# Altium project PDC_2019_rev2.PrjPcb
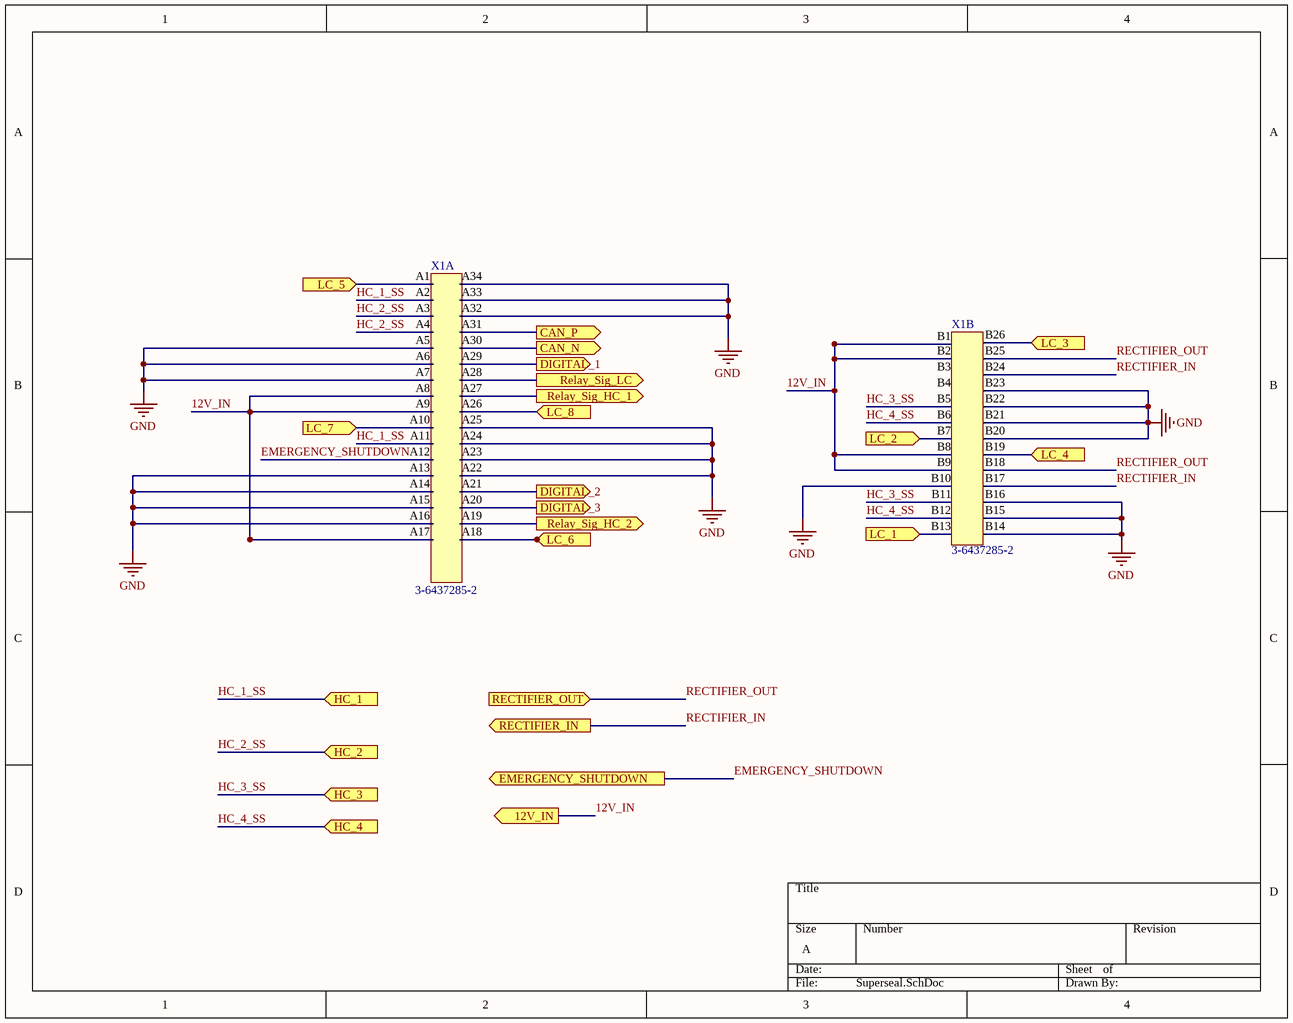
[diagram p0: Superseal.SchDoc]
9 sheets, 47 parts. Net scope: hierarchical (ports join the sheet entries above them; power ports are global).
Sheets:
  Superseal.SchDoc
  LOW_CURRENT_OUTPUTS.SchDoc
    U_Low_Current_Gate_Driver = Low_Current_Gate_Driver.SchDoc
    U_Low_Current_Gate_Driver = Low_Current_Gate_Driver.SchDoc
  HIGH_CURRENT_OUTPUT.SchDoc
    U_PDC_high_Current_Outputs = PDC_high_Current_Outputs.SchDoc
    U_PDC_high_Current_Outputs = PDC_high_Current_Outputs.SchDoc
    U_PDC_high_Current_Outputs = PDC_high_Current_Outputs.SchDoc
    U_PDC_high_Current_Outputs = PDC_high_Current_Outputs.SchDoc
  E_STOP_&_HIGH_CURRENT_GATE_DRIVE.SchDoc
  RECTIFIER_SHUTDOWN_CCT.SchDoc
  ANALOG_HC_OVERCURRENT_REDUCNDANCY.SchDoc
    U_Analog_HC_Overcurrent_Redundancy = Analog_HC_Overcurrent_Redundancy.SchDoc
    U_Analog_HC_Overcurrent_Redundancy = Analog_HC_Overcurrent_Redundancy.SchDoc
    U_Analog_HC_Overcurrent_Redundancy = Analog_HC_Overcurrent_Redundancy.SchDoc
    U_Analog_HC_Overcurrent_Redundancy = Analog_HC_Overcurrent_Redundancy.SchDoc

## Sheet Superseal.SchDoc
size A

### Parts
X1  3-6437285-2  [SUPERSEAL 60POS 90Deg]  (parts A,B of 2)

### Ports
12V_IN (out), CAN_N (out), CAN_P (out), DIGITAL_1 (out), DIGITAL_2 (out), DIGITAL_3 (out), EMERGENCY_SHUTDOWN (out), HC_1 (in), HC_2 (in), HC_3 (in), HC_4 (in), LC_1 (in), LC_2 (in), LC_3 (in), LC_4 (in), LC_5 (in), LC_6 (in), LC_7 (in), LC_8 (in), RECTIFIER_IN (out), RECTIFIER_OUT (in), Relay_Sig_HC_1 (out), Relay_Sig_HC_2 (out), Relay_Sig_LC (out)

### Nets
GND: X1.A5 X1.A6 X1.A7 X1.A13 X1.A14 X1.A15 X1.A16 X1.A22 X1.A23 X1.A24 X1.A25 X1.A32 X1.A33 X1.A34 X1.B10 X1.B14 X1.B15 X1.B16 X1.B20 X1.B21 X1.B22 X1.B23
12V_IN: X1.A8 X1.A9 X1.A17 X1.B1 X1.B2 X1.B8 X1.B9 ; port 12V_IN
EMERGENCY_SHUTDOWN: X1.A12 ; port EMERGENCY_SHUTDOWN
HC_1_SS: X1.A2 X1.A11 ; port HC_1
HC_2_SS: X1.A3 X1.A4 ; port HC_2
HC_3_SS: X1.B5 X1.B11 ; port HC_3
HC_4_SS: X1.B6 X1.B12 ; port HC_4
RECTIFIER_IN: X1.B17 X1.B24 ; port RECTIFIER_IN
RECTIFIER_OUT: X1.B18 X1.B25 ; port RECTIFIER_OUT
NetX1_A1: X1.A1 ; port LC_5
NetX1_A10: X1.A10 ; port LC_7
NetX1_A18: X1.A18 ; port LC_6
NetX1_A19: X1.A19 ; port Relay_Sig_HC_2
NetX1_A20: X1.A20 ; port DIGITAL_3
NetX1_A21: X1.A21 ; port DIGITAL_2
NetX1_A26: X1.A26 ; port LC_8
NetX1_A27: X1.A27 ; port Relay_Sig_HC_1
NetX1_A28: X1.A28 ; port Relay_Sig_LC
NetX1_A29: X1.A29 ; port DIGITAL_1
NetX1_A30: X1.A30 ; port CAN_N
NetX1_A31: X1.A31 ; port CAN_P
NetX1_B7: X1.B7 ; port LC_2
NetX1_B13: X1.B13 ; port LC_1
NetX1_B19: X1.B19 ; port LC_4
NetX1_B26: X1.B26 ; port LC_3

Not connected (* = marked no-connect by the designer): X1 B3 B4

### Library data of the parts
X1 = 3: 90 Degree; Manufacturer_id: 1; idConn: 3; Name: AMP Superseal 60POS 90Deg; Value: CONN; Num_Contacts: 60; Num_Rows: 4; Pitch: 3 mm; MfrPartNo: 3-6437285-2; Drawer_id: 1; Link: https://www.te.com/usa-en/product-3-6437285-2.html; ComponentLink1Description: Datasheet

## Sheet LOW_CURRENT_OUTPUTS.SchDoc
size A2
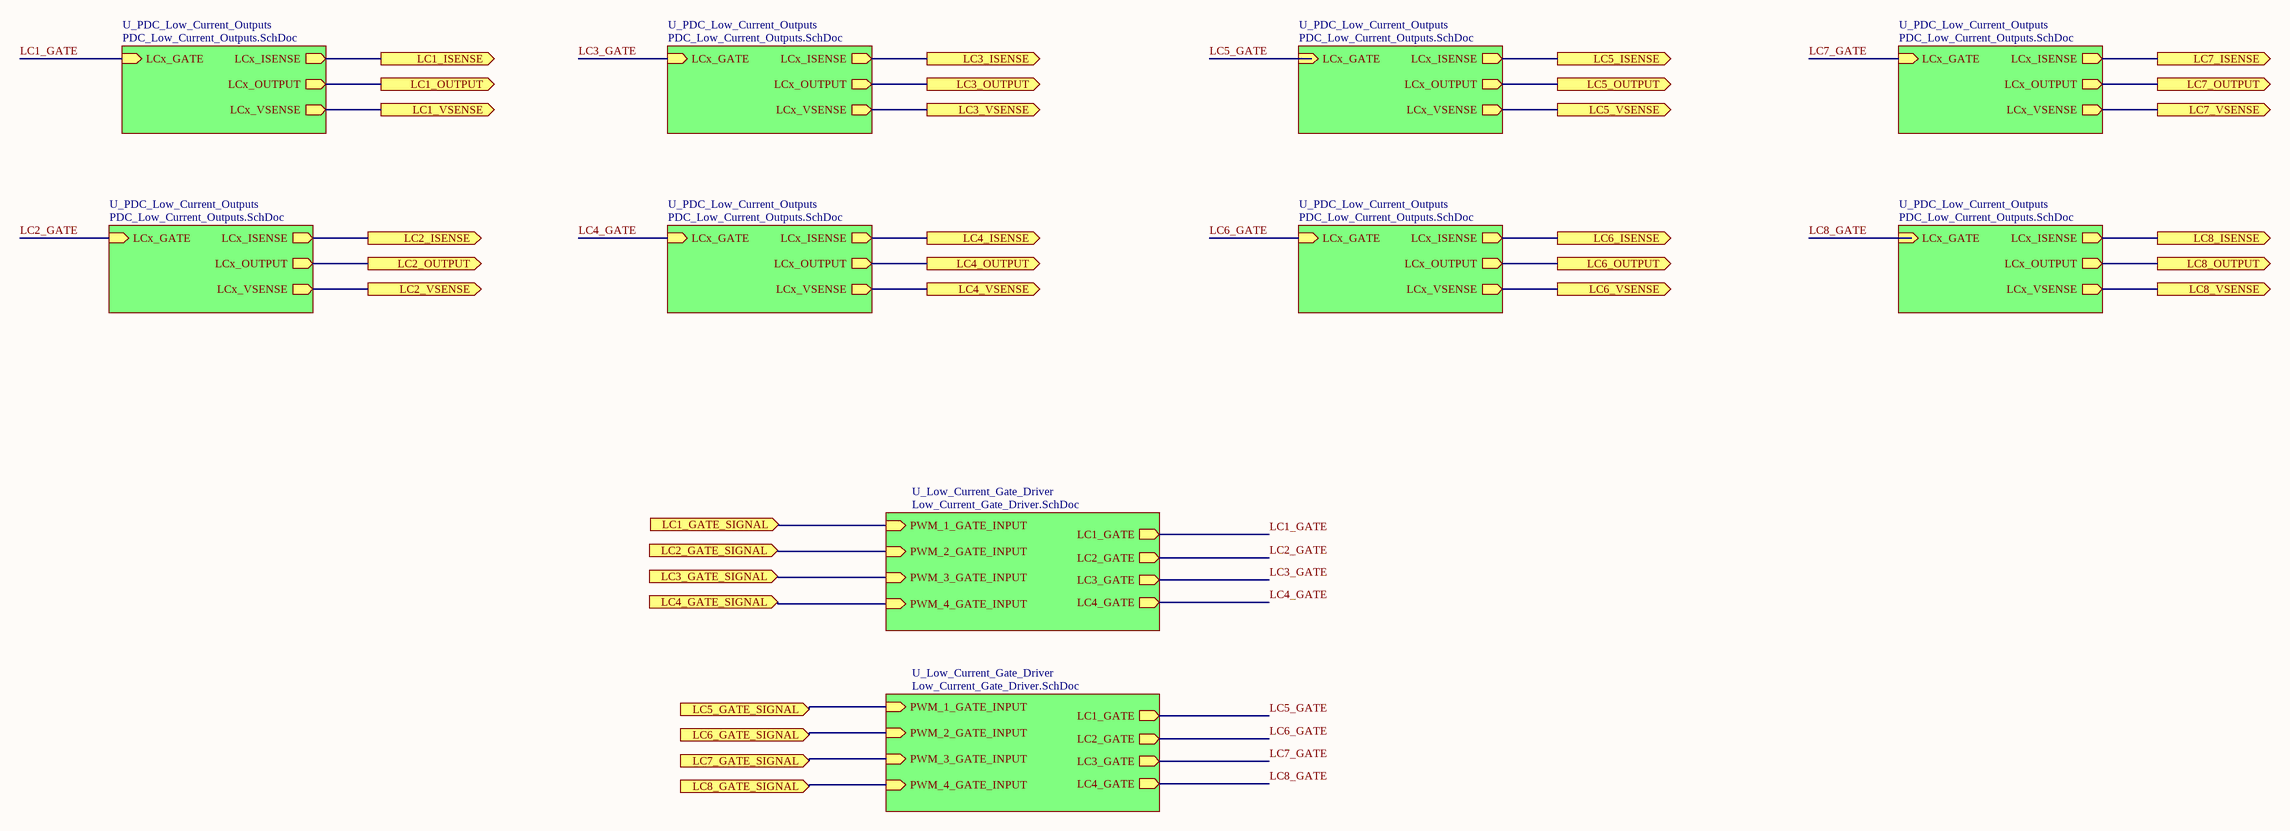
[diagram p1: LOW_CURRENT_OUTPUTS.SchDoc]

### Sub-sheets
U_Low_Current_Gate_Driver = Low_Current_Gate_Driver.SchDoc: LC4_GATE (out), LC2_GATE (out), LC1_GATE (out), LC3_GATE (out), PWM_1_GATE_INPUT (in), PWM_2_GATE_INPUT (in), PWM_3_GATE_INPUT (in), PWM_4_GATE_INPUT (in)
U_Low_Current_Gate_Driver = Low_Current_Gate_Driver.SchDoc: LC4_GATE (out), LC2_GATE (out), LC1_GATE (out), LC3_GATE (out), PWM_1_GATE_INPUT (in), PWM_2_GATE_INPUT (in), PWM_3_GATE_INPUT (in), PWM_4_GATE_INPUT (in)
U_PDC_Low_Current_Outputs = PDC_Low_Current_Outputs.SchDoc (file not in this document): LCx_ISENSE (out), LCx_OUTPUT (out), LCx_VSENSE (out), LCx_GATE (in)
U_PDC_Low_Current_Outputs = PDC_Low_Current_Outputs.SchDoc (file not in this document): LCx_ISENSE (out), LCx_OUTPUT (out), LCx_VSENSE (out), LCx_GATE (in)
U_PDC_Low_Current_Outputs = PDC_Low_Current_Outputs.SchDoc (file not in this document): LCx_ISENSE (out), LCx_OUTPUT (out), LCx_VSENSE (out), LCx_GATE (in)
U_PDC_Low_Current_Outputs = PDC_Low_Current_Outputs.SchDoc (file not in this document): LCx_ISENSE (out), LCx_OUTPUT (out), LCx_VSENSE (out), LCx_GATE (in)
U_PDC_Low_Current_Outputs = PDC_Low_Current_Outputs.SchDoc (file not in this document): LCx_ISENSE (out), LCx_OUTPUT (out), LCx_VSENSE (out), LCx_GATE (in)
U_PDC_Low_Current_Outputs = PDC_Low_Current_Outputs.SchDoc (file not in this document): LCx_ISENSE (out), LCx_OUTPUT (out), LCx_VSENSE (out), LCx_GATE (in)
U_PDC_Low_Current_Outputs = PDC_Low_Current_Outputs.SchDoc (file not in this document): LCx_ISENSE (out), LCx_OUTPUT (out), LCx_VSENSE (out), LCx_GATE (in)
U_PDC_Low_Current_Outputs = PDC_Low_Current_Outputs.SchDoc (file not in this document): LCx_ISENSE (out), LCx_OUTPUT (out), LCx_VSENSE (out), LCx_GATE (in)

### Ports
LC1_GATE_SIGNAL (in), LC1_ISENSE (out), LC1_OUTPUT (out), LC1_VSENSE (out), LC2_GATE_SIGNAL (in), LC2_ISENSE (out), LC2_OUTPUT (out), LC2_VSENSE (out), LC3_GATE_SIGNAL (in), LC3_ISENSE (out), LC3_OUTPUT (out), LC3_VSENSE (out), LC4_GATE_SIGNAL (in), LC4_ISENSE (out), LC4_OUTPUT (out), LC4_VSENSE (out), LC5_GATE_SIGNAL (in), LC5_ISENSE (out), LC5_OUTPUT (out), LC5_VSENSE (out), LC6_GATE_SIGNAL (in), LC6_ISENSE (out), LC6_OUTPUT (out), LC6_VSENSE (out), LC7_GATE_SIGNAL (in), LC7_ISENSE (out), LC7_OUTPUT (out), LC7_VSENSE (out), LC8_GATE_SIGNAL (in), LC8_ISENSE (out), LC8_OUTPUT (out), LC8_VSENSE (out)

### Nets
LC1_GATE: sheet U_PDC_Low_Current_Outputs/LCx_GATE, sheet U_Low_Current_Gate_Driver/LC1_GATE
LC2_GATE: sheet U_PDC_Low_Current_Outputs/LCx_GATE, sheet U_Low_Current_Gate_Driver/LC2_GATE
LC3_GATE: sheet U_PDC_Low_Current_Outputs/LCx_GATE, sheet U_Low_Current_Gate_Driver/LC3_GATE
LC4_GATE: sheet U_PDC_Low_Current_Outputs/LCx_GATE, sheet U_Low_Current_Gate_Driver/LC4_GATE
LC5_GATE: sheet U_PDC_Low_Current_Outputs/LCx_GATE, sheet U_Low_Current_Gate_Driver/LC1_GATE
LC6_GATE: sheet U_PDC_Low_Current_Outputs/LCx_GATE, sheet U_Low_Current_Gate_Driver/LC2_GATE
LC7_GATE: sheet U_PDC_Low_Current_Outputs/LCx_GATE, sheet U_Low_Current_Gate_Driver/LC3_GATE
LC8_GATE: sheet U_PDC_Low_Current_Outputs/LCx_GATE, sheet U_Low_Current_Gate_Driver/LC4_GATE
NetIC4_U_Low_Current_Gate_Driver#1_3: port LC5_GATE_SIGNAL, sheet U_Low_Current_Gate_Driver/PWM_1_GATE_INPUT
NetIC4_U_Low_Current_Gate_Driver#1_5: port LC6_GATE_SIGNAL, sheet U_Low_Current_Gate_Driver/PWM_2_GATE_INPUT
NetIC4_U_Low_Current_Gate_Driver#1_7: port LC7_GATE_SIGNAL, sheet U_Low_Current_Gate_Driver/PWM_3_GATE_INPUT
NetIC4_U_Low_Current_Gate_Driver#1_9: port LC8_GATE_SIGNAL, sheet U_Low_Current_Gate_Driver/PWM_4_GATE_INPUT
NetIC4_U_Low_Current_Gate_Driver#2_3: port LC1_GATE_SIGNAL, sheet U_Low_Current_Gate_Driver/PWM_1_GATE_INPUT
NetIC4_U_Low_Current_Gate_Driver#2_5: port LC2_GATE_SIGNAL, sheet U_Low_Current_Gate_Driver/PWM_2_GATE_INPUT
NetIC4_U_Low_Current_Gate_Driver#2_7: port LC3_GATE_SIGNAL, sheet U_Low_Current_Gate_Driver/PWM_3_GATE_INPUT
NetIC4_U_Low_Current_Gate_Driver#2_9: port LC4_GATE_SIGNAL, sheet U_Low_Current_Gate_Driver/PWM_4_GATE_INPUT
(unnamed): port LC3_ISENSE, sheet U_PDC_Low_Current_Outputs/LCx_ISENSE
(unnamed): port LC3_OUTPUT, sheet U_PDC_Low_Current_Outputs/LCx_OUTPUT
(unnamed): port LC3_VSENSE, sheet U_PDC_Low_Current_Outputs/LCx_VSENSE
(unnamed): port LC4_ISENSE, sheet U_PDC_Low_Current_Outputs/LCx_ISENSE
(unnamed): port LC4_OUTPUT, sheet U_PDC_Low_Current_Outputs/LCx_OUTPUT
(unnamed): port LC4_VSENSE, sheet U_PDC_Low_Current_Outputs/LCx_VSENSE
(unnamed): port LC1_ISENSE, sheet U_PDC_Low_Current_Outputs/LCx_ISENSE
(unnamed): port LC1_OUTPUT, sheet U_PDC_Low_Current_Outputs/LCx_OUTPUT
(unnamed): port LC1_VSENSE, sheet U_PDC_Low_Current_Outputs/LCx_VSENSE
(unnamed): port LC2_ISENSE, sheet U_PDC_Low_Current_Outputs/LCx_ISENSE
(unnamed): port LC2_OUTPUT, sheet U_PDC_Low_Current_Outputs/LCx_OUTPUT
(unnamed): port LC2_VSENSE, sheet U_PDC_Low_Current_Outputs/LCx_VSENSE
(unnamed): port LC5_ISENSE, sheet U_PDC_Low_Current_Outputs/LCx_ISENSE
(unnamed): port LC6_ISENSE, sheet U_PDC_Low_Current_Outputs/LCx_ISENSE
(unnamed): port LC6_OUTPUT, sheet U_PDC_Low_Current_Outputs/LCx_OUTPUT
(unnamed): port LC6_VSENSE, sheet U_PDC_Low_Current_Outputs/LCx_VSENSE
(unnamed): port LC7_ISENSE, sheet U_PDC_Low_Current_Outputs/LCx_ISENSE
(unnamed): port LC7_OUTPUT, sheet U_PDC_Low_Current_Outputs/LCx_OUTPUT
(unnamed): port LC7_VSENSE, sheet U_PDC_Low_Current_Outputs/LCx_VSENSE
(unnamed): port LC8_ISENSE, sheet U_PDC_Low_Current_Outputs/LCx_ISENSE
(unnamed): port LC8_OUTPUT, sheet U_PDC_Low_Current_Outputs/LCx_OUTPUT
(unnamed): port LC8_VSENSE, sheet U_PDC_Low_Current_Outputs/LCx_VSENSE
(unnamed): port LC5_OUTPUT, sheet U_PDC_Low_Current_Outputs/LCx_OUTPUT
(unnamed): port LC5_VSENSE, sheet U_PDC_Low_Current_Outputs/LCx_VSENSE

### Notes on the sheet
- Title
- Size:
- Date:
- File:
- A2
- Number:
- Time:
- Revision:
- Sheet
- of

## Sheet Low_Current_Gate_Driver.SchDoc
size A
Used 2 times, as channels U_Low_Current_Gate_Driver, U_Low_Current_Gate_Driver. Parts and nets are listed once, with the designators drawn on the sheet.
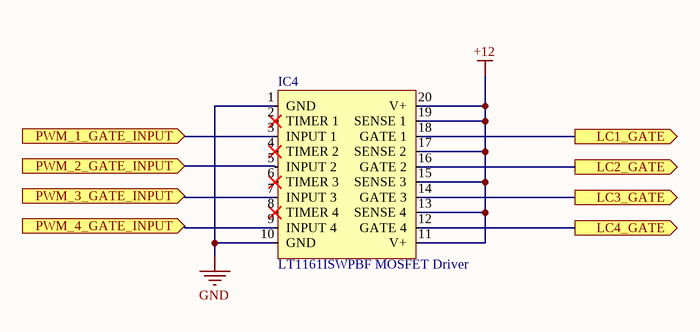
[diagram p2: Low_Current_Gate_Driver.SchDoc]

### Parts
IC4  LT1161ISWPBF MOSFET Driver  [SO-20]

### Ports
LC1_GATE (out), LC2_GATE (out), LC3_GATE (out), LC4_GATE (out), PWM_1_GATE_INPUT (in), PWM_2_GATE_INPUT (in), PWM_3_GATE_INPUT (in), PWM_4_GATE_INPUT (in)

### Nets
+12: IC4.11(V+) IC4.13(SENSE_4) IC4.15(SENSE_3) IC4.17(SENSE_2) IC4.19(SENSE_1) IC4.20(V+)
GND: IC4.1(GND) IC4.10(GND)
LC1_GATE: IC4.18(GATE_1) ; port LC1_GATE
LC2_GATE: IC4.16(GATE_2) ; port LC2_GATE
LC3_GATE: IC4.14(GATE_3) ; port LC3_GATE
LC4_GATE: IC4.12(GATE_4) ; port LC4_GATE
PWM_1_GATE_INPUT: IC4.3(INPUT_1) ; port PWM_1_GATE_INPUT
PWM_2_GATE_INPUT: IC4.5(INPUT_2) ; port PWM_2_GATE_INPUT
PWM_3_GATE_INPUT: IC4.7(INPUT_3) ; port PWM_3_GATE_INPUT
PWM_4_GATE_INPUT: IC4.9(INPUT_4) ; port PWM_4_GATE_INPUT

Not connected (* = marked no-connect by the designer): IC4 2(TIMER_1)* 4(TIMER_2)* 6(TIMER_3)* 8(TIMER_4)*

### Channels
U_Low_Current_Gate_Driver: designators end in _U_Low_Current_Gate_Driver#1; ports LC1_GATE=LC5_GATE LC2_GATE=LC6_GATE LC3_GATE=LC7_GATE LC4_GATE=LC8_GATE PWM_1_GATE_INPUT=NetIC4_U_Low_Current_Gate_Driver#1_3 PWM_2_GATE_INPUT=NetIC4_U_Low_Current_Gate_Driver#1_5 PWM_3_GATE_INPUT=NetIC4_U_Low_Current_Gate_Driver#1_7 PWM_4_GATE_INPUT=NetIC4_U_Low_Current_Gate_Driver#1_9
U_Low_Current_Gate_Driver: designators end in _U_Low_Current_Gate_Driver#2; ports LC1_GATE=LC1_GATE LC2_GATE=LC2_GATE LC3_GATE=LC3_GATE LC4_GATE=LC4_GATE PWM_1_GATE_INPUT=NetIC4_U_Low_Current_Gate_Driver#2_3 PWM_2_GATE_INPUT=NetIC4_U_Low_Current_Gate_Driver#2_5 PWM_3_GATE_INPUT=NetIC4_U_Low_Current_Gate_Driver#2_7 PWM_4_GATE_INPUT=NetIC4_U_Low_Current_Gate_Driver#2_9

### Library data of the parts
IC4 = 16: Manufacturer_id: 1; idIC_Misc: 16; Created_By: Eunice Bernardo; Drawer_id: 1; Name: LT1161ISWPBF MOSFET Driver; Created_Date: 10/27/2018

## Sheet HIGH_CURRENT_OUTPUT.SchDoc
size A
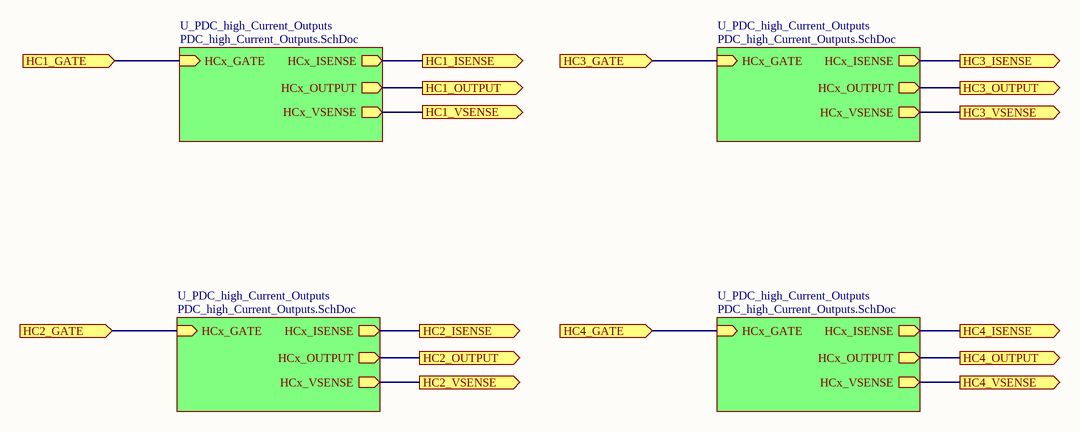
[diagram p3: HIGH_CURRENT_OUTPUT.SchDoc]

### Sub-sheets
U_PDC_high_Current_Outputs = PDC_high_Current_Outputs.SchDoc: HCx_ISENSE (out), HCx_OUTPUT (out), HCx_VSENSE (out), HCx_GATE (in)
U_PDC_high_Current_Outputs = PDC_high_Current_Outputs.SchDoc: HCx_ISENSE (out), HCx_OUTPUT (out), HCx_VSENSE (out), HCx_GATE (in)
U_PDC_high_Current_Outputs = PDC_high_Current_Outputs.SchDoc: HCx_ISENSE (out), HCx_OUTPUT (out), HCx_VSENSE (out), HCx_GATE (in)
U_PDC_high_Current_Outputs = PDC_high_Current_Outputs.SchDoc: HCx_ISENSE (out), HCx_OUTPUT (out), HCx_VSENSE (out), HCx_GATE (in)

### Ports
HC1_GATE (in), HC1_ISENSE (out), HC1_OUTPUT (out), HC1_VSENSE (out), HC2_GATE (in), HC2_ISENSE (out), HC2_OUTPUT (out), HC2_VSENSE (out), HC3_GATE (in), HC3_ISENSE (out), HC3_OUTPUT (out), HC3_VSENSE (out), HC4_GATE (in), HC4_ISENSE (out), HC4_OUTPUT (out), HC4_VSENSE (out)

### Nets
HCx_GATE_U_PDC_high_Current_Outputs: port HC1_GATE, sheet U_PDC_high_Current_Outputs/HCx_GATE
HCx_GATE_U_PDC_high_Current_Outputs: port HC2_GATE, sheet U_PDC_high_Current_Outputs/HCx_GATE  [a separate net that carries the same name]
HCx_GATE_U_PDC_high_Current_Outputs: port HC3_GATE, sheet U_PDC_high_Current_Outputs/HCx_GATE  [a separate net that carries the same name]
HCx_GATE_U_PDC_high_Current_Outputs: port HC4_GATE, sheet U_PDC_high_Current_Outputs/HCx_GATE  [a separate net that carries the same name]
NetR6_U_PDC_high_Current_Outputs#1_1: port HC1_VSENSE, sheet U_PDC_high_Current_Outputs/HCx_VSENSE
NetR6_U_PDC_high_Current_Outputs#1_2: port HC1_OUTPUT, sheet U_PDC_high_Current_Outputs/HCx_OUTPUT
NetR6_U_PDC_high_Current_Outputs#2_1: port HC2_VSENSE, sheet U_PDC_high_Current_Outputs/HCx_VSENSE
NetR6_U_PDC_high_Current_Outputs#2_2: port HC2_OUTPUT, sheet U_PDC_high_Current_Outputs/HCx_OUTPUT
NetR6_U_PDC_high_Current_Outputs#3_1: port HC3_VSENSE, sheet U_PDC_high_Current_Outputs/HCx_VSENSE
NetR6_U_PDC_high_Current_Outputs#3_2: port HC3_OUTPUT, sheet U_PDC_high_Current_Outputs/HCx_OUTPUT
NetR6_U_PDC_high_Current_Outputs#4_1: port HC4_VSENSE, sheet U_PDC_high_Current_Outputs/HCx_VSENSE
NetR6_U_PDC_high_Current_Outputs#4_2: port HC4_OUTPUT, sheet U_PDC_high_Current_Outputs/HCx_OUTPUT
NetU1_U_PDC_high_Current_Outputs#1_5: port HC1_ISENSE, sheet U_PDC_high_Current_Outputs/HCx_ISENSE
NetU1_U_PDC_high_Current_Outputs#2_5: port HC2_ISENSE, sheet U_PDC_high_Current_Outputs/HCx_ISENSE
NetU1_U_PDC_high_Current_Outputs#3_5: port HC3_ISENSE, sheet U_PDC_high_Current_Outputs/HCx_ISENSE
NetU1_U_PDC_high_Current_Outputs#4_5: port HC4_ISENSE, sheet U_PDC_high_Current_Outputs/HCx_ISENSE

### Notes on the sheet
- Title
- Size:
- Date:
- A
- Number:
- Time:
- Revision:
- Sheet
- of
- File:

## Sheet PDC_high_Current_Outputs.SchDoc
size A
Used 4 times, as channels U_PDC_high_Current_Outputs, U_PDC_high_Current_Outputs, U_PDC_high_Current_Outputs, U_PDC_high_Current_Outputs. Parts and nets are listed once, with the designators drawn on the sheet.
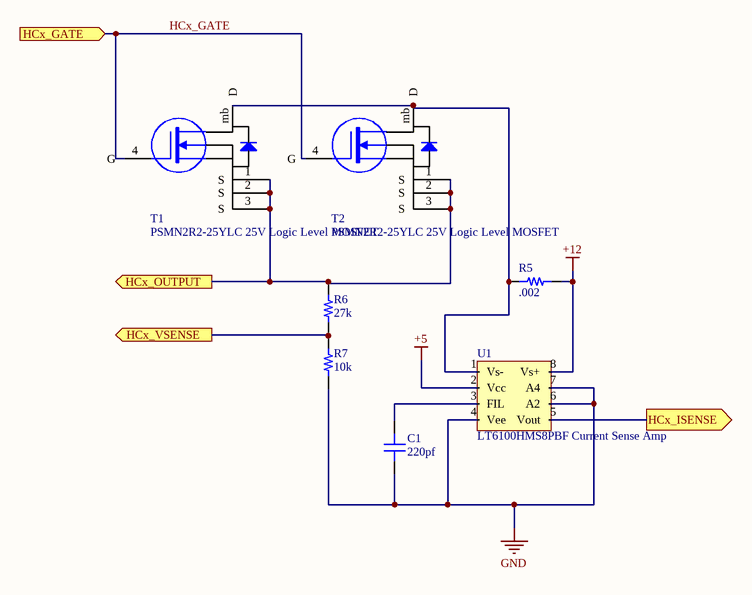
[diagram p4: PDC_high_Current_Outputs.SchDoc]

### Parts
C1  value 220pf  [CAP 0402/1005]  (hidden comment: Capacitor MLCC 220pf 16V CAP 0402/1005)
R5  value .002  [RES 2010/5025]  (hidden comment: Resistor .002 2010 1.5W 1%)
R6  value 27k  [RES 0805/2012]  (hidden comment: Resistor 27k 0805 1/10W 10%)
R7  value 10k  [RES 0402/1005]  (hidden comment: Resistor 10k 0402 1/10W 1%)
T1  PSMN2R2-25YLC 25V Logic Level MOSFET  [LFPAK-SO8]
T2  PSMN2R2-25YLC 25V Logic Level MOSFET  [LFPAK-SO8]
U1  LT6100HMS8PBF Current Sense Amp  [MSOP-8]

### Ports
HCx_GATE (in), HCx_ISENSE (out), HCx_OUTPUT (out), HCx_VSENSE (out)

### Nets
+5: U1.2(Vcc)
+12: R5.2 U1.8(Vs+)
GND: C1.1 R7.1 U1.4(Vee) U1.6(A2) U1.7(A4)
HCx_GATE: T1.4(G) T2.4(G) ; port HCx_GATE
HCx_ISENSE: U1.5(Vout) ; port HCx_ISENSE
HCx_OUTPUT: R6.2 T1.1(S) T1.2(S) T1.3(S) T2.1(S) T2.2(S) T2.3(S) ; port HCx_OUTPUT
HCx_VSENSE: R6.1 R7.2 ; port HCx_VSENSE
NetC1_2: C1.2 U1.3(FIL)
NetR5_1: R5.1 T1.mb(D) T2.mb(D) U1.1(Vs-)

### Channels
U_PDC_high_Current_Outputs: designators end in _U_PDC_high_Current_Outputs#1; ports HCx_GATE=HCx_GATE_U_PDC_high_Current_Outputs HCx_ISENSE=NetU1_U_PDC_high_Current_Outputs#1_5 HCx_OUTPUT=NetR6_U_PDC_high_Current_Outputs#1_2 HCx_VSENSE=NetR6_U_PDC_high_Current_Outputs#1_1
U_PDC_high_Current_Outputs: designators end in _U_PDC_high_Current_Outputs#2; ports HCx_GATE=HCx_GATE_U_PDC_high_Current_Outputs HCx_ISENSE=NetU1_U_PDC_high_Current_Outputs#2_5 HCx_OUTPUT=NetR6_U_PDC_high_Current_Outputs#2_2 HCx_VSENSE=NetR6_U_PDC_high_Current_Outputs#2_1
U_PDC_high_Current_Outputs: designators end in _U_PDC_high_Current_Outputs#3; ports HCx_GATE=HCx_GATE_U_PDC_high_Current_Outputs HCx_ISENSE=NetU1_U_PDC_high_Current_Outputs#3_5 HCx_OUTPUT=NetR6_U_PDC_high_Current_Outputs#3_2 HCx_VSENSE=NetR6_U_PDC_high_Current_Outputs#3_1
U_PDC_high_Current_Outputs: designators end in _U_PDC_high_Current_Outputs#4; ports HCx_GATE=HCx_GATE_U_PDC_high_Current_Outputs HCx_ISENSE=NetU1_U_PDC_high_Current_Outputs#4_5 HCx_OUTPUT=NetR6_U_PDC_high_Current_Outputs#4_2 HCx_VSENSE=NetR6_U_PDC_high_Current_Outputs#4_1

### Library data of the parts
C1 = 57: Manufacturer_id: 1; idCapacitor: 57; Name: Cap_220pf_16V_CAP 0402/1005; Dielectric: Ceramic; Created_By: Nick Mah; Drawer_id: 1; Voltage_Rating: 16V; Package: CAP 0402/1005; Created_Date: 10/20/2018
R5 = 2702: Current Sense Resistor; Manufacturer_id: 1; MfrPartNo: CSNL2010FT2L00; idResistor: 2702; Name: Res_.002_2010_1.5W_1%; Created_By: Angel; Supplier 1: Digi-Key; Supplier Part Number 1: Digi-Key; Drawer_id: 1; Tolerance: 1%; Power: 1.5W; Package: 2010; Link: https://www.digikey.com/product-detail/en/stackpole-electronics-inc/CSNL2010FT2L00/CSNL2010FT2L00CT-ND/1788126; ComponentLink1Description: Datasheet
R6 = 2430: Manufacturer_id: 1; idResistor: 2430; Name: Res_27k_0805_1/10W_10%; Created_By: Nick Mah; Supplier 1: Digi-Key; Drawer_id: 1; Tolerance: 10%; Power: 1/10W; Package: 0805; ComponentLink1Description: Datasheet; Created_Date: 2018-10-20
R7 = 97: Manufacturer_id: 1; idResistor: 97; Name: Res_10k_0402_1/10W_1%; Created_By: Nick Mah; Supplier 1: Digi-Key; Drawer_id: 1; Tolerance: 1%; Power: 1/10W; Package: 0402; ComponentLink1Description: Datasheet; Created_Date: 2018-10-20
T1 T2 = 3: N-Channel 25V 100A (Tc) 106W (Tc) Surface Mount LFPAK56, Power-SO8; Manufacturer_id: 6; MfrPartNo: PSMN2R2-25YLC,115; idFETs: 3; Drawer_id: 1; Value: N_Channel; Rds_On: 2.5mOhm; Vgs(typ): 10V; Vgs(Max): 20V; Created_By: Nick; Name: PSMN2R2; Vdss: 25V; Num_Circuits: 1; Id: 100A; Package: LFPAK-SO8; Link: https://www.digikey.com/product-detail/en/nexperia-usa-inc/PSMN2R2-25YLC115/1727-5299-1-ND/2674299; ComponentLink1Description: Datasheet; ComponentLink1URL: https://assets.nexperia.com/documents/data-sheet/PSMN2R2-25YLC.pdf; Supplier1: Digi-Key; Supplier1PartNo: 1727-5299-1-ND
U1 = 13: Manufacturer_id: 1; idIC_Misc: 13; Name: LT6100 Current Sense Amp; Created_By: Eddy; Drawer_id: 1; Package: MS8; Created_Date: 10/17/2018

## Sheet E_STOP_&_HIGH_CURRENT_GATE_DRIVE.SchDoc
size A
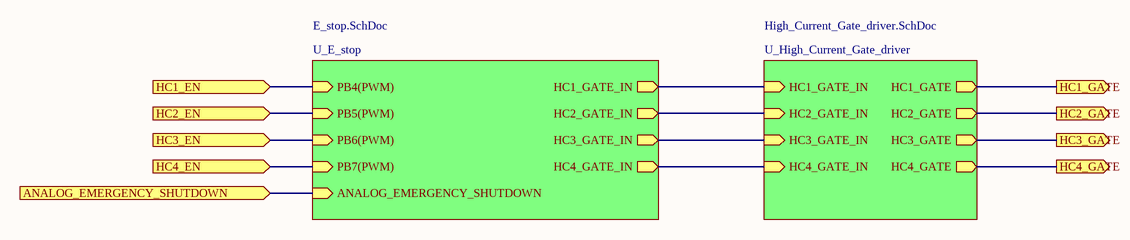
[diagram p5: E_STOP_&_HIGH_CURRENT_GATE_DRIVE.SchDoc]

### Sub-sheets
U_E_stop = E_stop.SchDoc (file not in this document): HC1_GATE_IN (out), HC2_GATE_IN (out), HC3_GATE_IN (out), HC4_GATE_IN (out), PB4(PWM) (in), PB5(PWM) (in), PB6(PWM) (in), PB7(PWM) (in), ANALOG_EMERGENCY_SHUTDOWN (in)
U_High_Current_Gate_driver = High_Current_Gate_driver.SchDoc (file not in this document): HC1_GATE (out), HC2_GATE (out), HC3_GATE (out), HC4_GATE (out), HC1_GATE_IN (in), HC2_GATE_IN (in), HC3_GATE_IN (in), HC4_GATE_IN (in)

### Ports
ANALOG_EMERGENCY_SHUTDOWN (in), HC1_EN (in), HC1_GATE (out), HC2_EN (in), HC2_GATE (out), HC3_EN (in), HC3_GATE (out), HC4_EN (in), HC4_GATE (out)

### Nets
(unnamed): port HC1_EN, sheet U_E_stop/PB4(PWM)
(unnamed): port HC2_EN, sheet U_E_stop/PB5(PWM)
(unnamed): port HC3_EN, sheet U_E_stop/PB6(PWM)
(unnamed): port HC4_EN, sheet U_E_stop/PB7(PWM)
(unnamed): port ANALOG_EMERGENCY_SHUTDOWN, sheet U_E_stop/ANALOG_EMERGENCY_SHUTDOWN
(unnamed): port HC1_GATE, sheet U_High_Current_Gate_driver/HC1_GATE
(unnamed): port HC2_GATE, sheet U_High_Current_Gate_driver/HC2_GATE
(unnamed): port HC3_GATE, sheet U_High_Current_Gate_driver/HC3_GATE
(unnamed): port HC4_GATE, sheet U_High_Current_Gate_driver/HC4_GATE
(unnamed): sheet U_E_stop/HC1_GATE_IN, sheet U_High_Current_Gate_driver/HC1_GATE_IN
(unnamed): sheet U_E_stop/HC2_GATE_IN, sheet U_High_Current_Gate_driver/HC2_GATE_IN
(unnamed): sheet U_E_stop/HC3_GATE_IN, sheet U_High_Current_Gate_driver/HC3_GATE_IN
(unnamed): sheet U_E_stop/HC4_GATE_IN, sheet U_High_Current_Gate_driver/HC4_GATE_IN

## Sheet RECTIFIER_SHUTDOWN_CCT.SchDoc
size A4
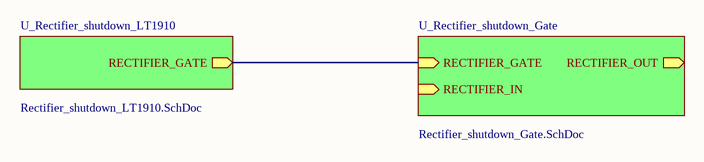
[diagram p6: RECTIFIER_SHUTDOWN_CCT.SchDoc]

### Sub-sheets
U_Rectifier_shutdown_Gate = Rectifier_shutdown_Gate.SchDoc (file not in this document): RECTIFIER_OUT (out), RECTIFIER_IN (in), RECTIFIER_GATE (in)
U_Rectifier_shutdown_LT1910 = Rectifier_shutdown_LT1910.SchDoc (file not in this document): RECTIFIER_GATE (out)

### Nets
(unnamed): sheet U_Rectifier_shutdown_Gate/RECTIFIER_GATE, sheet U_Rectifier_shutdown_LT1910/RECTIFIER_GATE

## Sheet ANALOG_HC_OVERCURRENT_REDUCNDANCY.SchDoc
size B
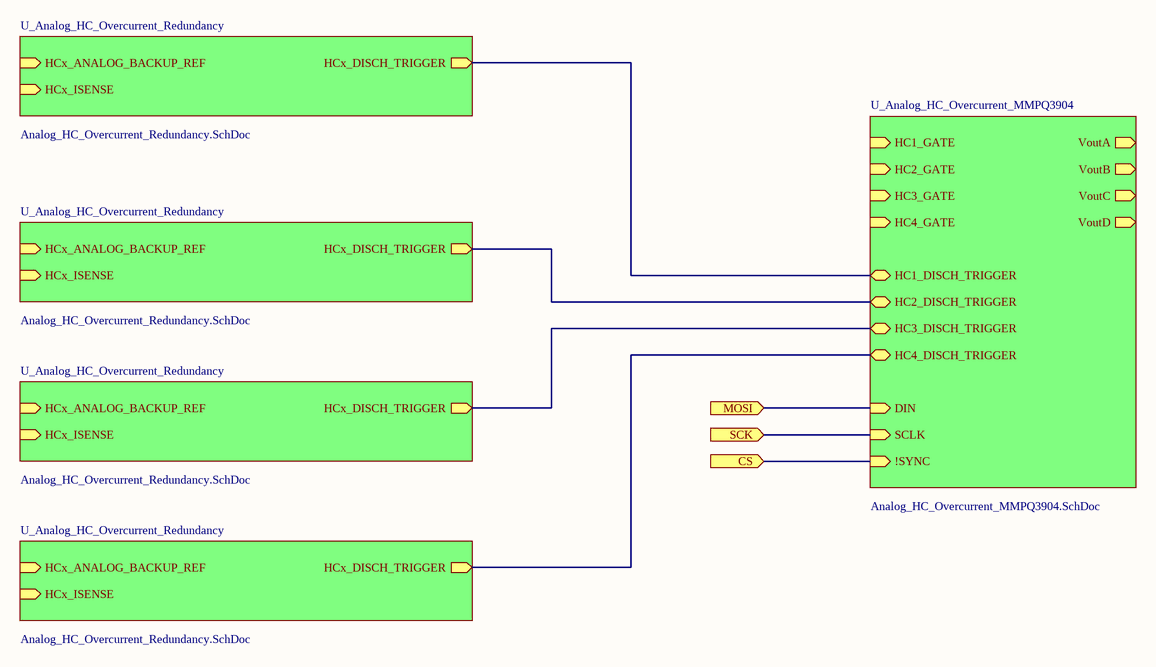
[diagram p7: ANALOG_HC_OVERCURRENT_REDUCNDANCY.SchDoc]

### Sub-sheets
U_Analog_HC_Overcurrent_MMPQ3904 = Analog_HC_Overcurrent_MMPQ3904.SchDoc (file not in this document): HC1_GATE (in), HC2_GATE (in), HC3_GATE (in), HC4_GATE (in), HC2_DISCH_TRIGGER (bidir), HC1_DISCH_TRIGGER (bidir), HC3_DISCH_TRIGGER (bidir), HC4_DISCH_TRIGGER (bidir), VoutA (out), VoutB (out), VoutC (out), VoutD (out), DIN (in), SCLK (in), !SYNC (in)
U_Analog_HC_Overcurrent_Redundancy = Analog_HC_Overcurrent_Redundancy.SchDoc: HCx_DISCH_TRIGGER (out), HCx_ANALOG_BACKUP_REF (in), HCx_ISENSE (in)
U_Analog_HC_Overcurrent_Redundancy = Analog_HC_Overcurrent_Redundancy.SchDoc: HCx_DISCH_TRIGGER (out), HCx_ANALOG_BACKUP_REF (in), HCx_ISENSE (in)
U_Analog_HC_Overcurrent_Redundancy = Analog_HC_Overcurrent_Redundancy.SchDoc: HCx_DISCH_TRIGGER (out), HCx_ANALOG_BACKUP_REF (in), HCx_ISENSE (in)
U_Analog_HC_Overcurrent_Redundancy = Analog_HC_Overcurrent_Redundancy.SchDoc: HCx_DISCH_TRIGGER (out), HCx_ANALOG_BACKUP_REF (in), HCx_ISENSE (in)

### Ports
CS (in), MOSI (in), SCK (in)

### Nets
NetR2_U_Analog_HC_Overcurrent_Redundancy#1_2: sheet U_Analog_HC_Overcurrent_MMPQ3904/HC1_DISCH_TRIGGER, sheet U_Analog_HC_Overcurrent_Redundancy/HCx_DISCH_TRIGGER
NetR2_U_Analog_HC_Overcurrent_Redundancy#2_2: sheet U_Analog_HC_Overcurrent_MMPQ3904/HC2_DISCH_TRIGGER, sheet U_Analog_HC_Overcurrent_Redundancy/HCx_DISCH_TRIGGER
NetR2_U_Analog_HC_Overcurrent_Redundancy#3_2: sheet U_Analog_HC_Overcurrent_MMPQ3904/HC3_DISCH_TRIGGER, sheet U_Analog_HC_Overcurrent_Redundancy/HCx_DISCH_TRIGGER
NetR2_U_Analog_HC_Overcurrent_Redundancy#4_2: sheet U_Analog_HC_Overcurrent_MMPQ3904/HC4_DISCH_TRIGGER, sheet U_Analog_HC_Overcurrent_Redundancy/HCx_DISCH_TRIGGER
(unnamed): port MOSI, sheet U_Analog_HC_Overcurrent_MMPQ3904/DIN
(unnamed): port SCK, sheet U_Analog_HC_Overcurrent_MMPQ3904/SCLK
(unnamed): port CS, sheet U_Analog_HC_Overcurrent_MMPQ3904/!SYNC

## Sheet Analog_HC_Overcurrent_Redundancy.SchDoc
size A
Used 4 times, as channels U_Analog_HC_Overcurrent_Redundancy, U_Analog_HC_Overcurrent_Redundancy, U_Analog_HC_Overcurrent_Redundancy, U_Analog_HC_Overcurrent_Redundancy. Parts and nets are listed once, with the designators drawn on the sheet.
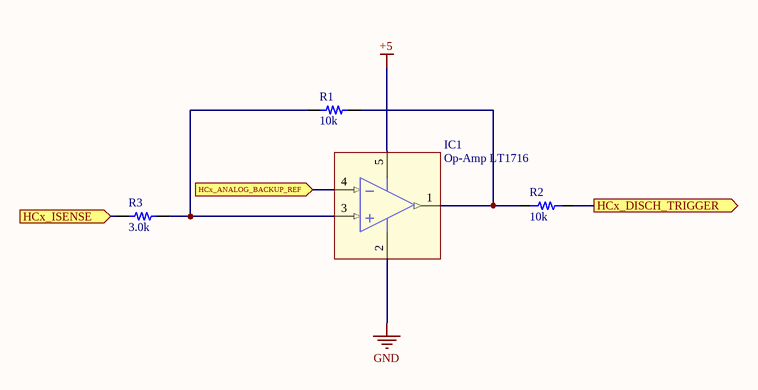
[diagram p8: Analog_HC_Overcurrent_Redundancy.SchDoc]

### Parts
IC1  Op-Amp LT1716  [SOT23-5]
R1  value 10k  [RES 0603/1608]  (hidden comment: Resistor 10k 0603 1/10W 1%)
R2  value 10k  [RES 0805/2012]  (hidden comment: Resistor 10k 0805 1/10W 1%)
R3  value 3.0k  [RES 0603/1608]  (hidden comment: Resistor 3.0k 0603 1/10W 1%)

### Ports
HCx_ANALOG_BACKUP_REF (in), HCx_DISCH_TRIGGER (out), HCx_ISENSE (in)

### Nets
+5: IC1.5(V+)
GND: IC1.2(V-)
HCx_ANALOG_BACKUP_REF: IC1.4(IN-) ; port HCx_ANALOG_BACKUP_REF
HCx_DISCH_TRIGGER: R2.2 ; port HCx_DISCH_TRIGGER
HCx_ISENSE: R3.1 ; port HCx_ISENSE
NetIC1_1: IC1.1(OUT) R1.2 R2.1
NetIC1_3: IC1.3(IN+) R1.1 R3.2

### Channels
U_Analog_HC_Overcurrent_Redundancy: designators end in _U_Analog_HC_Overcurrent_Redundancy#1; ports HCx_ANALOG_BACKUP_REF=NetIC1_U_Analog_HC_Overcurrent_Redundancy#1_4 HCx_DISCH_TRIGGER=NetR2_U_Analog_HC_Overcurrent_Redundancy#1_2 HCx_ISENSE=NetR3_U_Analog_HC_Overcurrent_Redundancy#1_1
U_Analog_HC_Overcurrent_Redundancy: designators end in _U_Analog_HC_Overcurrent_Redundancy#2; ports HCx_ANALOG_BACKUP_REF=NetIC1_U_Analog_HC_Overcurrent_Redundancy#2_4 HCx_DISCH_TRIGGER=NetR2_U_Analog_HC_Overcurrent_Redundancy#2_2 HCx_ISENSE=NetR3_U_Analog_HC_Overcurrent_Redundancy#2_1
U_Analog_HC_Overcurrent_Redundancy: designators end in _U_Analog_HC_Overcurrent_Redundancy#3; ports HCx_ANALOG_BACKUP_REF=NetIC1_U_Analog_HC_Overcurrent_Redundancy#3_4 HCx_DISCH_TRIGGER=NetR2_U_Analog_HC_Overcurrent_Redundancy#3_2 HCx_ISENSE=NetR3_U_Analog_HC_Overcurrent_Redundancy#3_1
U_Analog_HC_Overcurrent_Redundancy: designators end in _U_Analog_HC_Overcurrent_Redundancy#4; ports HCx_ANALOG_BACKUP_REF=NetIC1_U_Analog_HC_Overcurrent_Redundancy#4_4 HCx_DISCH_TRIGGER=NetR2_U_Analog_HC_Overcurrent_Redundancy#4_2 HCx_ISENSE=NetR3_U_Analog_HC_Overcurrent_Redundancy#4_1

### Library data of the parts
IC1 = 4: Manufacturer_id: 1; MfrPartNo: LT1716IS5#PBF; idOp_Amp: 4; Drawer_id: 1; Name: Op-Amp LT1716; Num_Circuits: 1
R1 = 313: Manufacturer_id: 1; idResistor: 313; Name: Res_10k_0603_1/10W_1%; Created_By: Nick Mah; Supplier 1: Digi-Key; Drawer_id: 1; Tolerance: 1%; Power: 1/10W; Package: 0603; ComponentLink1Description: Datasheet; Created_Date: 2018-10-20
R2 = 529: Manufacturer_id: 1; idResistor: 529; Name: Res_10k_0805_1/10W_1%; Created_By: Nick Mah; Supplier 1: Digi-Key; Drawer_id: 1; Tolerance: 1%; Power: 1/10W; Package: 0805; ComponentLink1Description: Datasheet; Created_Date: 2018-10-20
R3 = 300: Manufacturer_id: 1; idResistor: 300; Name: Res_3.0k_0603_1/10W_1%; Created_By: Nick Mah; Supplier 1: Digi-Key; Drawer_id: 1; Tolerance: 1%; Power: 1/10W; Package: 0603; ComponentLink1Description: Datasheet; Created_Date: 2018-10-20

## Nets that join several sheets
+5: U_PDC_high_Current_Outputs (U1_U_PDC_high_Current_Outputs#1.2), U_PDC_high_Current_Outputs (U1_U_PDC_high_Current_Outputs#2.2), U_PDC_high_Current_Outputs (U1_U_PDC_high_Current_Outputs#3.2), U_PDC_high_Current_Outputs (U1_U_PDC_high_Current_Outputs#4.2), U_Analog_HC_Overcurrent_Redundancy (IC1_U_Analog_HC_Overcurrent_Redundancy#1.5), U_Analog_HC_Overcurrent_Redundancy (IC1_U_Analog_HC_Overcurrent_Redundancy#2.5), U_Analog_HC_Overcurrent_Redundancy (IC1_U_Analog_HC_Overcurrent_Redundancy#3.5), U_Analog_HC_Overcurrent_Redundancy (IC1_U_Analog_HC_Overcurrent_Redundancy#4.5)
+12: U_Low_Current_Gate_Driver (6 pins), U_Low_Current_Gate_Driver (6 pins), U_PDC_high_Current_Outputs (R5_U_PDC_high_Current_Outputs#1.2 U1_U_PDC_high_Current_Outputs#1.8), U_PDC_high_Current_Outputs (R5_U_PDC_high_Current_Outputs#2.2 U1_U_PDC_high_Current_Outputs#2.8), U_PDC_high_Current_Outputs (R5_U_PDC_high_Current_Outputs#3.2 U1_U_PDC_high_Current_Outputs#3.8), U_PDC_high_Current_Outputs (R5_U_PDC_high_Current_Outputs#4.2 U1_U_PDC_high_Current_Outputs#4.8)
GND: Superseal (22 pins), U_Low_Current_Gate_Driver (IC4_U_Low_Current_Gate_Driver#1.1 IC4_U_Low_Current_Gate_Driver#1.10), U_Low_Current_Gate_Driver (IC4_U_Low_Current_Gate_Driver#2.1 IC4_U_Low_Current_Gate_Driver#2.10), U_PDC_high_Current_Outputs (5 pins), U_PDC_high_Current_Outputs (5 pins), U_PDC_high_Current_Outputs (5 pins), U_PDC_high_Current_Outputs (5 pins), U_Analog_HC_Overcurrent_Redundancy (IC1_U_Analog_HC_Overcurrent_Redundancy#1.2), U_Analog_HC_Overcurrent_Redundancy (IC1_U_Analog_HC_Overcurrent_Redundancy#2.2), U_Analog_HC_Overcurrent_Redundancy (IC1_U_Analog_HC_Overcurrent_Redundancy#3.2), U_Analog_HC_Overcurrent_Redundancy (IC1_U_Analog_HC_Overcurrent_Redundancy#4.2)